# EAGLE design ExtraCore (EAGLE 5.11)
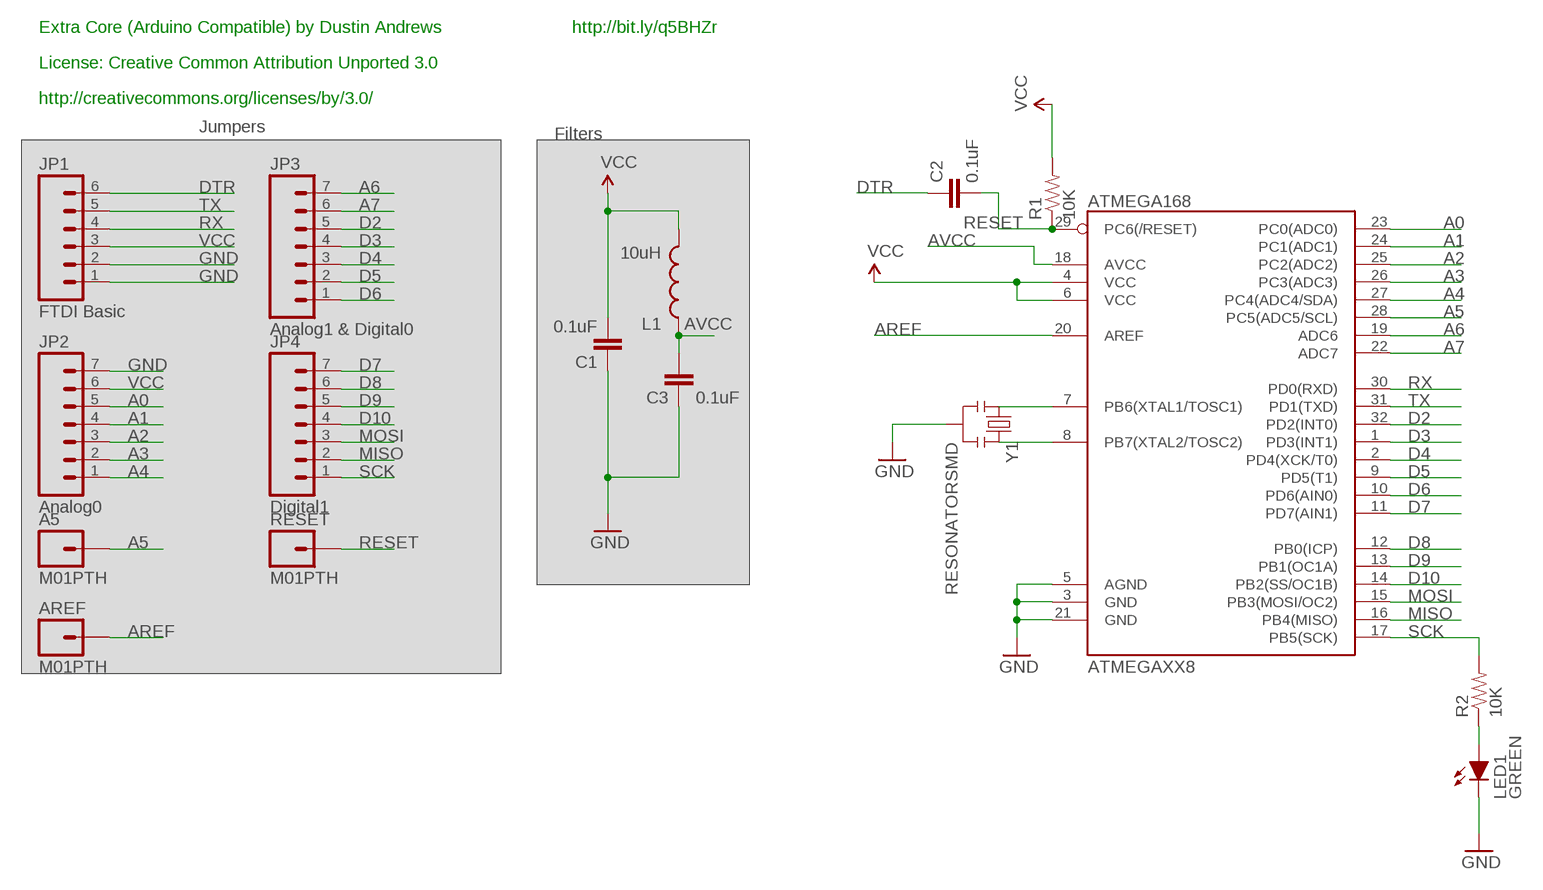
[diagram p0: schematic, sheet 1]

## Parts
A5  M01PTH  [1X01]
AREF  M01PTH  [1X01]
ATMEGAXX8  ATMEGA168  [TQFP32-08]
C1  0.1uF  CAP0805  [0805]
C2  0.1uF  CAP0805  [0805]
C3  0.1uF  CAP0805  [0805]
JP1  FTDI Basic  M06SIP  [1X06]
JP2  Analog0  M07  [1X07]
JP3  Analog1 & Digital0  M07  [1X07]
JP4  Digital1  M07  [1X07]
L1  10uH  INDUCTOR0805  [0805]
LED1  GREEN  LED1206  [LED1206]
R1  10K  RESISTOR0805-RES  [0805]
R2  10K  RESISTOR0805-RES  [0805]
RESET  M01PTH  [1X01]
Y1  RESONATORSMD  [RESONATOR-SMD]

## Nets
A0: ATMEGAXX8.23(PC0(ADC0)) JP2.5
A1: ATMEGAXX8.24(PC1(ADC1)) JP2.4
A2: ATMEGAXX8.25(PC2(ADC2)) JP2.3
A3: ATMEGAXX8.26(PC3(ADC3)) JP2.2
A4: ATMEGAXX8.27(PC4(ADC4/SDA)) JP2.1
A5: A5.1 ATMEGAXX8.28(PC5(ADC5/SCL))
A6: ATMEGAXX8.19(ADC6) JP3.7
A7: ATMEGAXX8.22(ADC7) JP3.6
AREF: AREF.1 ATMEGAXX8.20(AREF)
AVCC: ATMEGAXX8.18(AVCC) C3.2 L1.1
D2: ATMEGAXX8.32(PD2(INT0)) JP3.5
D3: ATMEGAXX8.1(PD3(INT1)) JP3.4
D4: ATMEGAXX8.2(PD4(XCK/T0)) JP3.3
D5: ATMEGAXX8.9(PD5(T1)) JP3.2
D6: ATMEGAXX8.10(PD6(AIN0)) JP3.1
D7: ATMEGAXX8.11(PD7(AIN1)) JP4.7
D8: ATMEGAXX8.12(PB0(ICP)) JP4.6
D9: ATMEGAXX8.13(PB1(OC1A)) JP4.5
D10: ATMEGAXX8.14(PB2(SS/OC1B)) JP4.4
DTR: C2.1 JP1.6
GND: ATMEGAXX8.3(GND) ATMEGAXX8.5(AGND) ATMEGAXX8.21(GND) C1.1 C3.1 JP1.1 JP1.2 JP2.7 LED1.K Y1.2
MISO: ATMEGAXX8.16(PB4(MISO)) JP4.2
MOSI: ATMEGAXX8.15(PB3(MOSI/OC2)) JP4.3
N$3: ATMEGAXX8.7(PB6(XTAL1/TOSC1)) Y1.1
N$4: ATMEGAXX8.8(PB7(XTAL2/TOSC2)) Y1.3
N$6: LED1.A R2.1
RESET: ATMEGAXX8.29(PC6(/RESET)) C2.2 R1.1 RESET.1
RX: ATMEGAXX8.30(PD0(RXD)) JP1.4
SCK: ATMEGAXX8.17(PB5(SCK)) JP4.1 R2.2
TX: ATMEGAXX8.31(PD1(TXD)) JP1.5
VCC: ATMEGAXX8.4(VCC) ATMEGAXX8.6(VCC) C1.2 JP1.3 JP2.6 L1.2 R1.2

## Notes on the sheet
- Extra Core (Arduino Compatible) by Dustin Andrews | http://bit.ly/q5BHZr
- License: Creative Common Attribution Unported 3.0
- http://creativecommons.org/licenses/by/3.0/
- Jumpers
- Filters

## Library data of the parts
A5 AREF RESET = SparkFun:M01: Header 1 Standard 1-pin 0.1" header. Use with straight break away headers (SKU : PRT-00116), right angle break away headers (PRT-00553), swiss pins (PRT-00743), machine pins (PRT-00117), and female headers (PRT-00115).
ATMEGAXX8 = SparkFun:ATMEGA168
C1-C3 = SparkFun:CAP: Capacitor Standard 0603 ceramic capacitor, and 0.1" leaded capacitor.
JP1 = SparkFun:M06: Header 6 Standard 6-pin 0.1" header. Use with straight break away headers (SKU : PRT-00116), right angle break away headers (PRT-00553), swiss pins (PRT-00743), machine pins (PRT-00117), and female headers (PRT-00115). Molex polarized connector foot print use with SKU : PRT-08094 with associated crimp pins and housings. NOTES ON THE VARIANTS LOCK and LOCK_LONGPADS... This footprint was designed to help hold the alignment of a through-hole component (i.e. 6-pin header) while soldering it into place. You may notice that each hole has been shifted either up or down by 0.005 of an inch from it's more standard position (which is a perfectly straight line). This slight alteration caused the pins (the squares in the middle) to touch the edges of the holes. Because they are alternating, it causes a "brace" to hold the component in place. 0.005 has proven to be the perfect amount of "off-center" position when using our standard breakaway headers. Although looks a little odd when you look at the bare footprint, once you have a header in there, the alteration is very hard to notice. Also, if you push a header all the way into place, it is covered up entirely on the bottom side. This idea of altering the position of holes to aid alignment will be further integrated into the Sparkfun Library for other footprints. It can help hold any component with 3 or more connection pins.
JP2-JP4 = SparkFun:M07: Header 7 Standard 7-pin 0.1" header. Use with straight break away headers (SKU : PRT-00116), right angle break away headers (PRT-00553), swiss pins (PRT-00743), machine pins (PRT-00117), and female headers (PRT-00115). NOTES ON THE VARIANTS LOCK and LOCK_LONGPADS... This footprint was designed to help hold the alignment of a through-hole component (i.e. 7-pin header) while soldering it into place. You may notice that each hole has been shifted either up or down by 0.005 of an inch from it's more standard position (which is usually a perfectly straight line). This slight alteration caused the pins (the squares in the middle) to touch the edges of the holes. Because they are alternating, it causes a "brace" to hold the header in place. 0.005 has proven to be the perfect amount of "off-center" position when using our standard breakaway headers. Although looks a little odd when you look at the bare footprint, once you have a header in there, the alteration is very hard to notice. Also, if you push a header all the way into place, it is covered up entirely on the bottom side. This idea of altering the position of holes to aid alignment will be further integrated into the Sparkfun Library for other footprints. It can help hold any component with 3 or more connection pins.
L1 = SparkFun:INDUCTOR: Inductors Basic Inductor/Choke - 0603 and 1206. Footprints are not proven and vary greatly between part numbers.
LED1 = Magnum:LED: LED
R1 R2 = SparkFun:RESISTOR: Resistor Basic schematic elements and footprints for 0603, 1206, and PTH resistors.
Y1 = SparkFun:RESONATOR: Resonator Small SMD resonator. This is the itty bitty 10/20MHz resonators with built in caps. CSTCE10M0G55 and CSTCE20M0V53. Footprint has been reviewed closely but hasn't been tested yet.

## Board
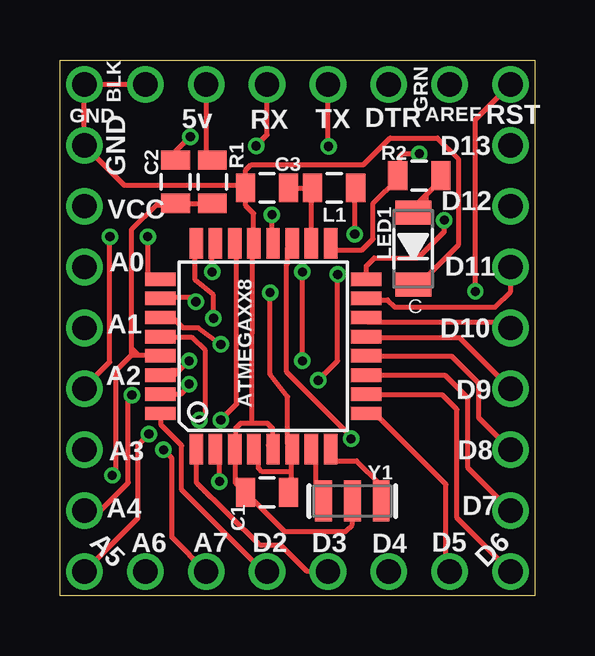
[diagram p1: board, top side]
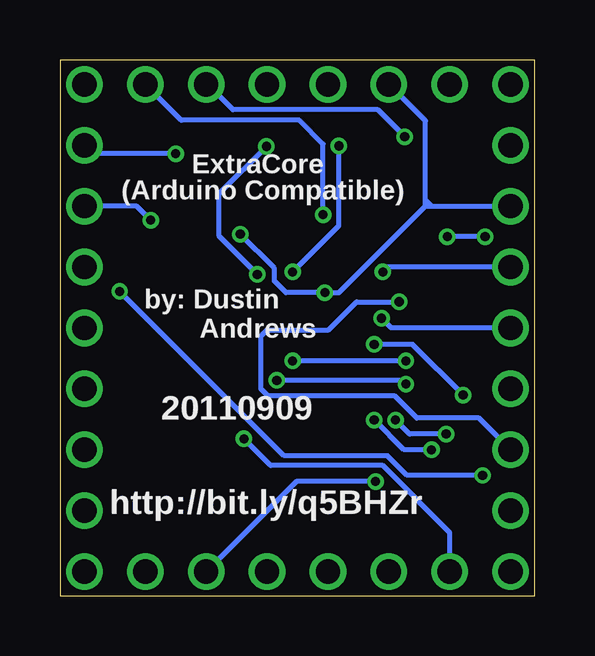
[diagram p2: board, bottom side, seen from below]

Size 19.81 x 22.35 mm. Coordinates in mm from the lower left corner, seen from the top.
Outline: 0,0 0,22.35 19.81,22.35 19.81,0 0,0
Copper layers (1*16): Top 0.0178mm / dielectric 1.4986mm / Bottom 0.0178mm
Design rules "SSC-EAGLE-2Lyr_v1.0.0.3 *": minimum track width 8mil, minimum drill 15mil, track to track 8mil, track to pad 8mil, pad to pad 8mil, via to via 8mil, smd to smd 0mil, copper to edge 9mil, drill to drill 16mil, minimum pad ring 8mil, minimum via ring 6mil, stop-mask expansion 2mil, vias tented up to drill 0mil, thermal gap 10mil

### Footprints (pad centres in the part's own frame; a part is rotated, then mirrored left to right if it is on the bottom)
1X01 = drill 1.016 pad 1.422 round: 1 0,0
TQFP32-08 = smd 1.27 x 0.559: 1 -4.293,2.8; 2 -4.293,2; 3 -4.293,1.2; 4 -4.293,0.4; 5 -4.293,-0.4; 6 -4.293,-1.2; 7 -4.293,-2; 8 -4.293,-2.8; 17 4.293,-2.8; 18 4.293,-2; 19 4.293,-1.2; 20 4.293,-0.4; 21 4.293,0.4; 22 4.293,1.2; 23 4.293,2; 24 4.293,2.8 | smd 0.559 x 1.27: 9 -2.8,-4.293; 10 -2,-4.293; 11 -1.2,-4.293; 12 -0.4,-4.293; 13 0.4,-4.293; 14 1.2,-4.293; 15 2,-4.293; 16 2.8,-4.293; 25 2.8,4.293; 26 2,4.293; 27 1.2,4.293; 28 0.4,4.293; 29 -0.4,4.293; 30 -1.2,4.293; 31 -2,4.293; 32 -2.8,4.293
0805 = smd 0.8 x 1.2: 1 -0.9,0; 2 0.9,0
1X06 = drill 1.016 pad 1.422 round: 1 0,0; 2 2.54,0; 3 5.08,0; 4 7.62,0; 5 10.16,0; 6 12.7,0
1X07 = drill 1.016 pad 1.422 round: 1 0,0; 2 2.54,0; 3 5.08,0; 4 7.62,0; 5 10.16,0; 6 12.7,0; 7 15.24,0
LED1206 = smd 1 x 1.5: A -1.5,0; K 1.5,0
RESONATOR-SMD = smd 0.7 x 1.7: 1 -1.2,0; 2 0,0; 3 1.2,0

### Placement (x,y rotation side)
A5  1.02,1.02 0 top
AREF  16.26,21.34 0 top
ATMEGAXX8  8.48,10.41 90 top
C1  8.64,4.32 0 top
C2  4.83,17.27 270 top
C3  8.64,17.02 0 top
JP1  1.02,21.34 0 top
JP2  1.02,3.56 90 top
JP3  18.8,1.02 180 top
JP4  18.8,18.8 270 top
L1  11.43,17.02 0 top
LED1  14.73,14.48 270 top
R1  6.35,17.27 90 top
R2  14.99,17.53 180 top
RESET  18.8,21.34 0 top
Y1  12.19,3.96 0 top

### Tracks (layer width: path | path; a pad name or v marks a point on that pad's centre or on a via)
A0  (via drill 0.38)
  Top 0.203: v6.35,13.51 6.35,14.58 6.45,14.68 ATMEGAXX8.23
  Bottom 0.203: JP2.5 6.15,13.72 v6.35,13.51
A1  (via drill 0.38)
  Top 0.203: v6.4,11.58 6.4,12.55 5.64,13.18 5.64,14.68 | 5.64,14.68 5.64,14.73 | 5.64,14.68 ATMEGAXX8.24
  Bottom 0.203: v6.4,11.58 5.99,11.18 JP2.4
A2  (via drill 0.38)
  Top 0.203: v3.66,14.99 3.66,13.39 4.17,13.26 ATMEGAXX8.25 | v2.08,14.99 2.08,9.75 1.02,8.69 JP2.3
  Bottom 0.203: v2.08,14.99 v3.66,14.99
A3  (via drill 0.38)
  Top 0.203: ATMEGAXX8.26 4.22,12.45 5.49,12.45 v5.66,12.27
  Bottom 0.203: JP2.2 2.34,7.42 4.93,7.42 5.84,8.33 11.12,8.33 11.43,8.64 11.43,10.85 11.18,11.1 8.61,11.1 7.44,12.27 v5.66,12.27
A4  (via drill 0.38)
  Top 0.203: v3,8.38 2.85,8.23 2.85,4.72 1.68,3.56 JP2.1 | 4.6,11.58 4.22,11.58 ATMEGAXX8.27 4.7,11.61 5.13,11.18 5.77,11.18 v6.71,10.49
  Bottom 0.203: v6.71,10.49 5.11,10.49 v3,8.38
A5  (via drill 0.38)
  Top 0.203: v3.71,6.76 3.25,6.3 3.25,3.25 A5.1 | ATMEGAXX8.28 4.22,10.77 5.51,10.77 6.07,10.24 6.07,7.59 v5.82,7.34
  Bottom 0.203: v5.82,7.34 5.23,6.76 v3.71,6.76
A6  (via drill 0.38)
  Top 0.203: v12.14,6.55 12.14,6.66 9.45,9.35 9.45,13.82 9.5,13.87 9.5,14.53 9.65,14.68 ATMEGAXX8.19
  Bottom 0.203: v12.14,6.55 11.02,5.44 6.35,5.44 3.56,2.64 JP3.7
A7  (via drill 0.38)
  Top 0.203: v6.71,7.34 7.37,8 7.37,14.63 7.32,14.68 ATMEGAXX8.22 | v4.32,6.1 4.67,5.74 4.67,2.44 JP3.6
  Bottom 0.203: v4.32,6.1 5.46,6.1 v6.71,7.34
AREF  (via drill 0.38)
  Top 0.203: v8.84,15.9 8.84,14.73 ATMEGAXX8.20
  Bottom 0.203: v8.84,15.9 8.84,18.85 9.83,19.84 14.76,19.84 15.19,20.27 15.24,20.32 AREF.1
AVCC
  Top 0.203: C3.2 L1.1 10.46,16.97 10.46,14.73 ATMEGAXX8.18
D2
  Top 0.203: JP3.5 8.48,1.02 5.08,4.42 5.08,6.27 4.22,7.14 4.22,7.57 ATMEGAXX8.32
D3
  Top 0.203: JP3.4 10.29,1.04 9.2,2.13 8.33,2.13 5.69,4.72 ATMEGAXX8.1
  Top 0.254: ATMEGAXX8.1
D4  (via drill 0.38)
  Top 0.203: v6.66,4.78 6.66,5.94 6.5,6.1 ATMEGAXX8.2
  Bottom 0.203: v6.66,4.78 9.96,4.78 JP3.3
D5
  Top 0.203: JP3.2 16.1,1.17 16.1,4.65 13.36,7.39 ATMEGAXX8.9
D6
  Top 0.203: JP3.1 16.56,3.25 16.56,7.77 15.95,8.38 12.8,8.38 ATMEGAXX8.10
D7
  Top 0.203: JP4.7 17.02,5.33 17.02,8.26 16.08,9.2 12.8,9.2 ATMEGAXX8.11
D8
  Top 0.203: JP4.6 17.45,7.44 17.45,8.89 16.33,10.01 12.8,10.01 ATMEGAXX8.12
D9
  Top 0.203: JP4.5 16.66,10.77 12.8,10.77 ATMEGAXX8.13
D10
  Top 0.203: JP4.4 18.8,11.43 12.8,11.43 ATMEGAXX8.14
DTR  (via drill 0.38)
  Top 0.203: C2.1 4.83,18.54 v5.44,19.15
  Bottom 0.203: v5.44,19.15 6.55,20.27 12.6,20.27 13.66,21.34 JP1.6
GND
  Top 0.203: JP1.2 JP1.1 JP2.7 2.69,17.12 7.72,17.12 C3.1 | ATMEGAXX8.3 7.32,6.1 7.32,4.72 7.72,4.32 C1.1 9.36,2.69 11.91,2.69 12.19,2.97 Y1.2 | 8.69,6.3 8.84,6.15 ATMEGAXX8.5 8.87,6.14 8.87,6.99 8.64,7.21 8,7.21 | ATMEGAXX8.3 7.32,6.2 | C3.1 7.77,17.02 | LED1.K 14.73,13.01 14.99,13.01 16.61,14.63 16.61,18.24 15.75,19.1 13.77,19.1 12.65,17.98 7.98,17.98 7.75,17.75 C3.1 | C3.1 7.82,17.07 | 8,7.21 8.03,14.63 ATMEGAXX8.21 8.08,14.73 8.08,15.95 7.75,16.28 7.75,17.01 C3.1 | 8,7.21 7.54,7.21 7.34,7.01 7.34,6.18 ATMEGAXX8.3
MISO  (via drill 0.38)
  Top 0.203: 12.8,13.26 ATMEGAXX8.16 12.78,13.77 13.11,14.1 14.94,14.1 16.03,15.19 v16.03,15.67
  Bottom 0.203: JP4.2 16.61,16.26 v16.03,15.67
MOSI
  Top 0.203: JP4.3 18.8,12.7 18.14,12.04 13.97,12.04 13.66,12.34 13.08,12.34 12.8,12.39 ATMEGAXX8.15
N$3
  Top 0.203: ATMEGAXX8.7 10.52,6.1 10.67,5.94 10.67,4.27 10.97,3.96 Y1.1
N$4
  Top 0.203: ATMEGAXX8.8 11.33,6.1 11.33,5.64 12.37,5.64 13.36,4.65 13.36,3.96 Y1.3
N$6
  Top 0.203: R2.1 15.89,17.33 15.27,16.71 | 15.27,16.71 14.76,16.2 14.73,16 LED1.A | 15.27,16.71 15.27,16.41
RESET  (via drill 0.38)
  Top 0.203: R1.1 6.35,16.36 4.83,16.36 C2.2 4.78,16.31 4.01,16.31 3,15.29 3,10.31 | 3,10.06 3.25,10.06 | 3.25,10.06 4.17,10.06 ATMEGAXX8.29 | 3,10.06 3,10.31 | RESET.1 17.32,19.86 v17.32,12.7 | v2.18,5.03 2.34,5.18 2.34,9.4 3,10.06 | 3.25,10.06 3,10.31
  Bottom 0.203: v17.32,12.7 10.46,5.84 6.15,5.84 5.33,5.03 v2.18,5.03
RX  (via drill 0.38)
  Top 0.203: 4.98,9.4 4.83,9.25 4.22,9.25 ATMEGAXX8.30 | 4.98,9.4 v5.38,9.8 | v10.11,9.8 v10.11,13.51 | JP1.4 8.64,19.23 v8.18,18.77 | 4.98,9.4 4.62,9.4
  Bottom 0.203: v5.38,9.8 v10.11,9.8 | v10.11,13.51 8.18,15.44 v8.18,18.77
SCK  (via drill 0.38)
  Top 0.203: ATMEGAXX8.17 11.33,14.68 11.33,14.43 12.6,14.43 13.06,14.88 13.06,16.38 14.09,17.41 R2.2 14.17,17.58 14.17,18.34 14.28,18.44 v14.99,18.44
  Bottom 0.203: JP4.1 18.44,18.44 v14.99,18.44
TX  (via drill 0.38)
  Top 0.203: v11.58,13.41 11.58,9.8 v10.77,8.99 | 4.22,8.43 ATMEGAXX8.31 4.21,8.43 5.05,8.43 5.38,8.76 v5.38,8.84 | JP1.5 11.18,18.77 v11.2,18.75
  Bottom 0.203: v5.38,8.84 5.54,8.99 v10.77,8.99 | v11.58,13.41 13.17,15 13.17,16.78 v11.2,18.75
VCC  (via drill 0.38)
  Top 0.203: JP1.3 6.1,18.44 6.35,18.19 R1.2 | 9.65,5.18 9.65,6.1 ATMEGAXX8.6 9.65,6.2 9.5,6.35 9.5,8.31 8.76,9.25 v8.76,12.65 | 9.65,5.18 9.65,4.42 C1.2 | ATMEGAXX8.4 8.13,6.1 8.28,5.94 8.28,5.33 8.43,5.18 9.65,5.18 | v12.29,15.09 12.29,17.02 L1.2
  Bottom 0.203: v12.29,15.09 10.87,13.66 10.87,13.13 10.39,12.65 v8.76,12.65 8.18,12.65 4.57,16.26 | 4.57,16.26 4.32,16.26 | 4.32,16.26 JP2.6 | JP1.3 4.57,19.81 4.57,16.26 | 4.55,16.48 4.32,16.26

### Text on the board
tPlace: GRN | BLK | GND | 5v | TX | DTR | AREF | RST | RX | GND | D13 | VCC | D12 | A0 | D11 | C | A1 | D10 | A2 | D9 | A3 | D8 | A4 | A6 | D2 | D7 | A5 | A7 | D3 | D4 | D5 | D6
bPlace: ExtraCore | by: Dustin | Andrews | http://bit.ly/q5BHZr
bNames: (Arduino Compatible) | 20110909
Measures: 0.78" x 0.88"